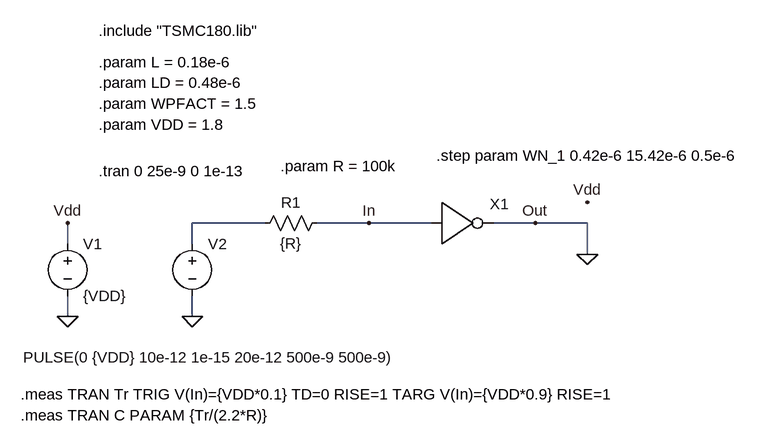
[diagram p0: schematic inverter_gate_cap_test.asc]
inverter_gate_cap_test.asc, the LTspice schematic file:
Version 4
SHEET 1 2756 1748
WIRE 944 208 832 208
WIRE 1104 208 1024 208
WIRE 1200 208 1104 208
WIRE 1360 208 1296 208
WIRE 1440 208 1360 208
WIRE 640 240 640 208
WIRE 832 240 832 208
WIRE 1440 256 1440 208
WIRE 640 352 640 320
WIRE 832 352 832 320
FLAG 1104 208 In
FLAG 640 352 0
FLAG 640 208 Vdd
FLAG 832 352 0
FLAG 1440 256 0
FLAG 1440 176 Vdd
FLAG 1360 208 Out
SYMBOL voltage 640 224 R0
WINDOW 123 0 0 Left 0
WINDOW 39 0 0 Left 0
SYMATTR InstName V1
SYMATTR Value {VDD}
SYMBOL voltage 832 224 R0
WINDOW 123 0 0 Left 0
WINDOW 39 0 0 Left 0
WINDOW 3 -260 191 Left 2
SYMATTR Value PULSE(0 {VDD} 10e-12 1e-15 20e-12 500e-9 500e-9)
SYMATTR InstName V2
SYMBOL inversor 1216 208 R0
SYMATTR InstName X1
SYMATTR SpiceLine VDD=1.8 L=0.18u LD=0.48u WN={WN_1} WPFACT=1.5
SYMBOL res 1040 192 R90
WINDOW 0 0 56 VBottom 2
WINDOW 3 32 56 VTop 2
SYMATTR InstName R1
SYMATTR Value {R}
TEXT 688 -88 Left 2 !.include "TSMC180.lib"
TEXT 688 -40 Left 2 !.param L = 0.18e-6
TEXT 688 -8 Left 2 !.param LD = 0.48e-6
TEXT 688 56 Left 2 !.param VDD = 1.8
TEXT 688 128 Left 2 !.tran 0 25e-9 0 1e-13
TEXT 688 24 Left 2 !.param WPFACT = 1.5
TEXT 1208 104 Left 2 !.step param WN_1 0.42e-6 15.42e-6 0.5e-6
TEXT 568 472 Left 2 !.meas TRAN Tr TRIG V(In)={VDD*0.1} TD=0 RISE=1 TARG V(In)={VDD*0.9} RISE=1
TEXT 568 504 Left 2 !.meas TRAN C PARAM {Tr/(2.2*R)}
TEXT 968 120 Left 2 !.param R = 100k

The netlist it stands for:
* inverter_gate_cap_test.asc
V1 Vdd 0 {VDD}
V2 N001 0 PULSE(0 {VDD} 10e-12 1e-15 20e-12 500e-9 500e-9)
XX1 In 0 inversor VDD=1.8 L=0.18u LD=0.48u WN={WN_1} WPFACT=1.5  ; pins In Out
R1 In N001 {R}
.include "TSMC180.lib"
.param L = 0.18e-6
.param LD = 0.48e-6
.param VDD = 1.8
.tran 0 25e-9 0 1e-13
.param WPFACT = 1.5
.step param WN_1 0.42e-6 15.42e-6 0.5e-6
.meas TRAN Tr TRIG V(In)={VDD*0.1} TD=0 RISE=1 TARG V(In)={VDD*0.9} RISE=1
.meas TRAN C PARAM {Tr/(2.2*R)}
.param R = 100k
.backanno
.end